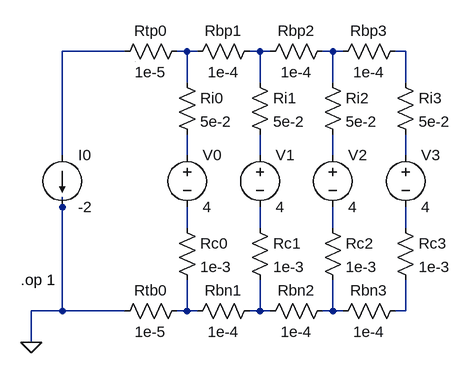
[diagram p0: schematic 4p1s.asc]
4p1s.asc, the LTspice schematic file:
Version 4
SHEET 1 880 680
WIRE -16 -16 -112 -16
WIRE 80 -16 64 -16
WIRE 96 -16 80 -16
WIRE 192 -16 176 -16
WIRE 208 -16 192 -16
WIRE 304 -16 288 -16
WIRE 320 -16 304 -16
WIRE 416 -16 400 -16
WIRE 80 32 80 -16
WIRE 192 32 192 -16
WIRE 304 32 304 -16
WIRE 416 32 416 -16
WIRE -112 144 -112 -16
WIRE 80 144 80 112
WIRE 192 144 192 112
WIRE 304 144 304 112
WIRE 416 144 416 112
WIRE -112 224 -112 208
WIRE 80 256 80 224
WIRE 192 256 192 224
WIRE 304 256 304 224
WIRE 416 256 416 224
WIRE -112 384 -112 224
WIRE -112 384 -160 384
WIRE -16 384 -112 384
WIRE 80 384 80 336
WIRE 80 384 64 384
WIRE 96 384 80 384
WIRE 192 384 192 336
WIRE 192 384 176 384
WIRE 208 384 192 384
WIRE 304 384 304 336
WIRE 304 384 288 384
WIRE 320 384 304 384
WIRE 416 384 416 336
WIRE 416 384 400 384
WIRE -160 432 -160 384
WIRE 0 0 0 0
FLAG -160 432 0
SYMBOL voltage 80 128 R0
WINDOW 123 0 0 Left 0
WINDOW 39 24 124 Left 2
SYMATTR InstName V0
SYMATTR Value 4
SYMBOL voltage 192 128 R0
WINDOW 123 0 0 Left 0
WINDOW 39 0 0 Left 0
SYMATTR InstName V1
SYMATTR Value 4
SYMBOL voltage 304 128 R0
WINDOW 123 0 0 Left 0
WINDOW 39 0 0 Left 0
SYMATTR InstName V2
SYMATTR Value 4
SYMBOL voltage 416 128 R0
WINDOW 123 0 0 Left 0
WINDOW 39 0 0 Left 0
SYMATTR InstName V3
SYMATTR Value 4
SYMBOL res 64 16 R0
SYMATTR InstName Ri0
SYMATTR Value 5e-2
SYMBOL res 176 16 R0
SYMATTR InstName Ri1
SYMATTR Value 5e-2
SYMBOL res 288 16 R0
SYMATTR InstName Ri2
SYMATTR Value 5e-2
SYMBOL res 400 16 R0
SYMATTR InstName Ri3
SYMATTR Value 5e-2
SYMBOL res 64 240 R0
SYMATTR InstName Rc0
SYMATTR Value 1e-3
SYMBOL res 176 240 R0
SYMATTR InstName Rc1
SYMATTR Value 1e-3
SYMBOL res 288 240 R0
SYMATTR InstName Rc2
SYMATTR Value 1e-3
SYMBOL res 400 240 R0
SYMATTR InstName Rc3
SYMATTR Value 1e-3
SYMBOL res 192 -32 R90
WINDOW 0 0 56 VBottom 2
WINDOW 3 32 56 VTop 2
SYMATTR InstName Rbp1
SYMATTR Value 1e-4
SYMBOL res 304 -32 R90
WINDOW 0 0 56 VBottom 2
WINDOW 3 32 56 VTop 2
SYMATTR InstName Rbp2
SYMATTR Value 1e-4
SYMBOL res 416 -32 R90
WINDOW 0 0 56 VBottom 2
WINDOW 3 32 56 VTop 2
SYMATTR InstName Rbp3
SYMATTR Value 1e-4
SYMBOL res 80 -32 R90
WINDOW 0 0 56 VBottom 2
WINDOW 3 32 56 VTop 2
SYMATTR InstName Rtp0
SYMATTR Value 1e-5
SYMBOL res 80 368 R90
WINDOW 0 0 56 VBottom 2
WINDOW 3 32 56 VTop 2
SYMATTR InstName Rtb0
SYMATTR Value 1e-5
SYMBOL res 192 368 R90
WINDOW 0 0 56 VBottom 2
WINDOW 3 32 56 VTop 2
SYMATTR InstName Rbn1
SYMATTR Value 1e-4
SYMBOL res 304 368 R90
WINDOW 0 0 56 VBottom 2
WINDOW 3 32 56 VTop 2
SYMATTR InstName Rbn2
SYMATTR Value 1e-4
SYMBOL res 416 368 R90
WINDOW 0 0 56 VBottom 2
WINDOW 3 32 56 VTop 2
SYMATTR InstName Rbn3
SYMATTR Value 1e-4
SYMBOL current -112 144 R0
WINDOW 123 0 0 Left 0
WINDOW 39 0 0 Left 0
SYMATTR InstName I0
SYMATTR Value -2
TEXT -176 336 Left 2 !.op 1

The netlist it stands for:
* 4p1s.asc
V0 N006 N010 4
V1 N007 N011 4
V2 N008 N012 4
V3 N009 N013 4
Ri0 N002 N006 5e-2
Ri1 N003 N007 5e-2
Ri2 N004 N008 5e-2
Ri3 N005 N009 5e-2
Rc0 N010 N014 1e-3
Rc1 N011 N015 1e-3
Rc2 N012 N016 1e-3
Rc3 N013 N017 1e-3
Rbp1 N003 N002 1e-4
Rbp2 N004 N003 1e-4
Rbp3 N005 N004 1e-4
Rtp0 N002 N001 1e-5
Rtb0 N014 0 1e-5
Rbn1 N015 N014 1e-4
Rbn2 N016 N015 1e-4
Rbn3 N017 N016 1e-4
I0 N001 0 -2
.op 1
.backanno
.end